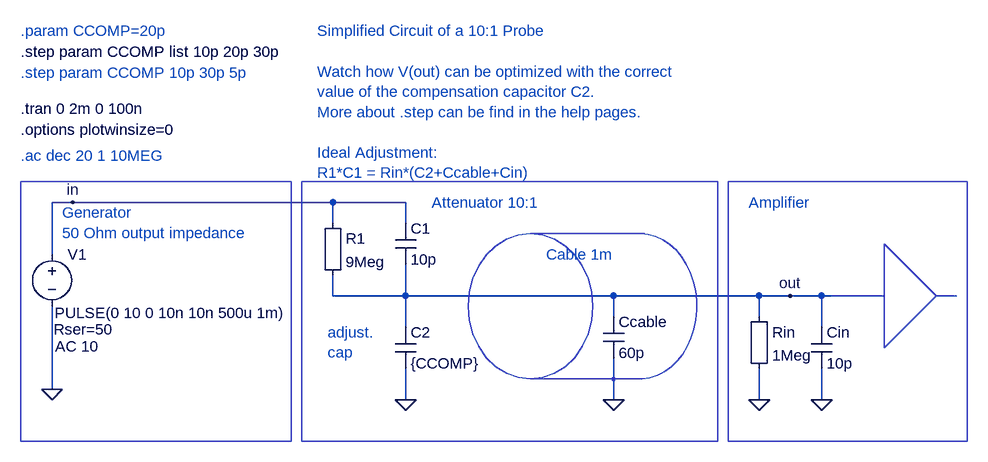
[diagram p0: schematic ltc003_OSC_Probe_simple.asc]
ltc003_OSC_Probe_simple.asc, the LTspice schematic file:
Version 4
SHEET 1 1908 680
WIRE -64 64 -96 64
WIRE 336 64 -64 64
WIRE 448 64 336 64
WIRE 336 96 336 64
WIRE 448 96 448 64
WIRE -96 144 -96 64
WIRE 336 208 336 176
WIRE 448 208 448 160
WIRE 448 208 336 208
WIRE 768 208 448 208
WIRE 992 208 768 208
WIRE 1040 208 992 208
WIRE 1088 208 1040 208
WIRE 1104 208 1088 208
WIRE 768 240 768 208
WIRE 992 240 992 208
WIRE 448 256 448 208
WIRE 1088 256 1088 208
WIRE -96 352 -96 224
WIRE 448 368 448 320
WIRE 768 368 768 304
WIRE 992 368 992 320
WIRE 1088 368 1088 320
FLAG -96 352 0
FLAG 448 368 0
FLAG 768 368 0
FLAG 992 368 0
FLAG 1088 368 0
FLAG 1040 208 out
FLAG -64 64 in
SYMBOL voltage -96 128 R0
WINDOW 123 5 158 Left 2
WINDOW 39 3 132 Left 2
WINDOW 3 4 106 Left 2
SYMATTR Value2 AC 10
SYMATTR SpiceLine Rser=50
SYMATTR InstName V1
SYMATTR Value PULSE(0 10 0 10n 10n 500u 1m)
SYMBOL cap 432 96 R0
SYMATTR InstName C1
SYMATTR Value 10p
SYMBOL cap 752 240 R0
SYMATTR InstName Ccable
SYMATTR Value 60p
SYMBOL cap 1072 256 R0
SYMATTR InstName Cin
SYMATTR Value 10p
SYMBOL cap 432 256 R0
SYMATTR InstName C2
SYMATTR Value {CCOMP}
SYMBOL Misc\\EuropeanResistor 320 80 R0
SYMATTR InstName R1
SYMATTR Value 9Meg
SYMBOL Misc\\EuropeanResistor 976 224 R0
SYMATTR InstName Rin
SYMATTR Value 1Meg
TEXT -144 -168 Left 2 !.step param CCOMP list 10p 20p 30p
TEXT -144 -80 Left 2 !.tran 0 2m 0 100n
TEXT -144 -48 Left 2 !.options plotwinsize=0
TEXT 488 64 Left 2 ;Attenuator 10:1
TEXT 976 64 Left 2 ;Amplifier
TEXT 664 144 Left 2 ;Cable 1m
TEXT 328 264 Left 2 ;adjust. \ncap
TEXT 312 -200 Left 2 ;Simplified Circuit of a 10:1 Probe\n \nWatch how V(out) can be optimized with the correct \nvalue of the compensation capacitor C2.\nMore about .step can be find in the help pages.\n \nIdeal Adjustment: \nR1*C1 = Rin*(C2+Ccable+Cin)
TEXT -80 80 Left 2 ;Generator \n50 Ohm output impedance
TEXT -144 -200 Left 2 ;.param CCOMP=20p
TEXT -144 -136 Left 2 ;.step param CCOMP 10p 30p 5p
TEXT -144 -8 Left 2 ;.ac dec 20 1 10MEG
LINE Normal 1184 288 1184 128
LINE Normal 1264 208 1184 288
LINE Normal 1184 128 1264 208
LINE Normal 1184 208 1104 208
LINE Normal 1296 208 1264 208
LINE Normal 800 336 640 336
LINE Normal 816 112 640 112
RECTANGLE Normal 1312 432 944 32
RECTANGLE Normal 768 336 768 336
RECTANGLE Normal 784 336 768 336
RECTANGLE Normal 770 338 766 334
RECTANGLE Normal 272 432 -144 32
RECTANGLE Normal 928 432 288 32
CIRCLE Normal 736 336 544 112
ARC Normal 720 112 896 336 794 431 810 111

The netlist it stands for:
* ltc003_OSC_Probe_simple.asc
V1 in 0 PULSE(0 10 0 10n 10n 500u 1m) AC 10 Rser=50
C1 in out 10p
Ccable out 0 60p
Cin out 0 10p
C2 out 0 {CCOMP}
R1 in out 9Meg
Rin out 0 1Meg
.step param CCOMP list 10p 20p 30p
.tran 0 2m 0 100n
.options plotwinsize=0
* Attenuator 10:1
* Amplifier
* Cable 1m
* adjust.
* cap
* Simplified Circuit of a 10:1 Probe
* Watch how V(out) can be optimized with the correct
* value of the compensation capacitor C2.
* More about .step can be find in the help pages.
* Ideal Adjustment:
* R1*C1 = Rin*(C2+Ccable+Cin)
* Generator
* 50 Ohm output impedance
* .param CCOMP=20p
* .step param CCOMP 10p 30p 5p
* .ac dec 20 1 10MEG
.backanno
.end